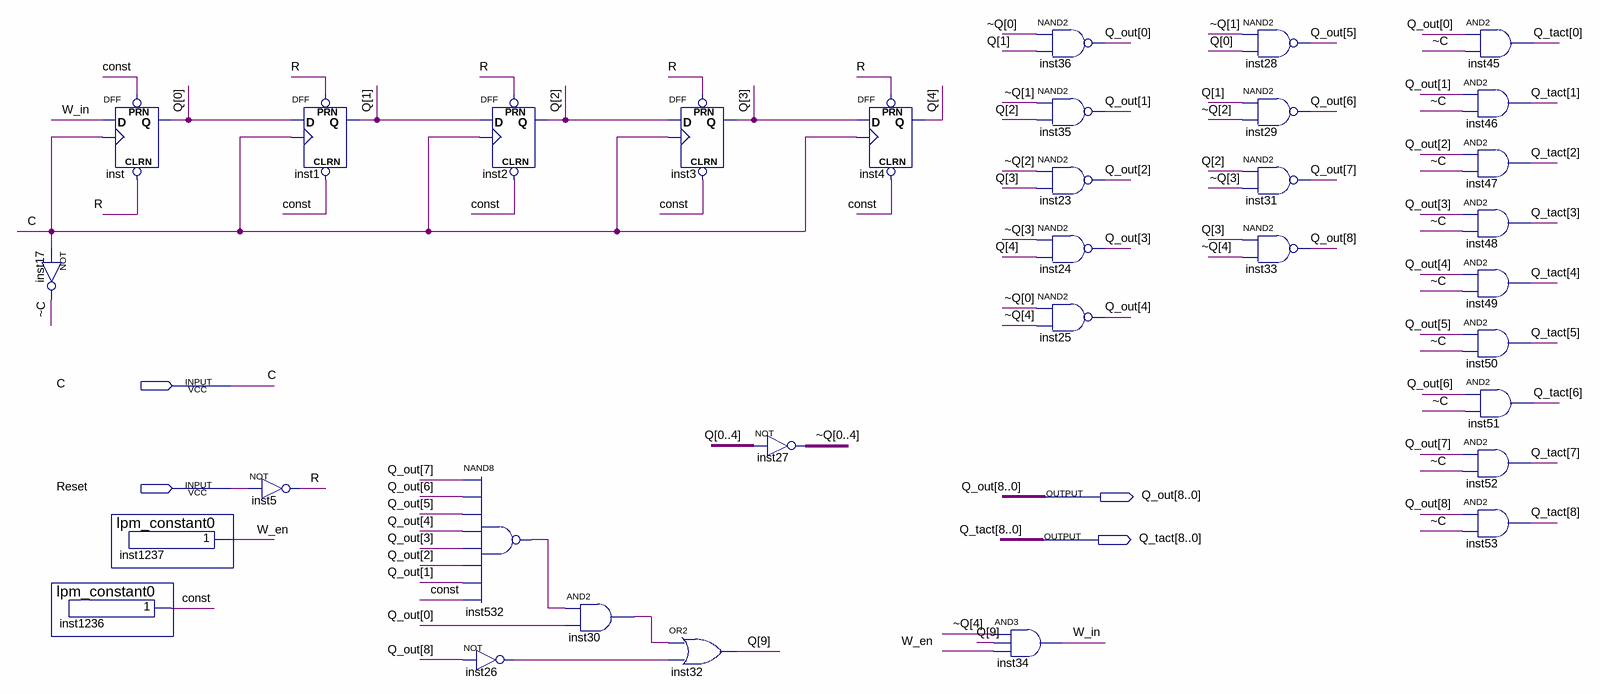
[diagram p0: schematic sheet]
// Quartus schematic Lab6_2.bdf as structural Verilog: 33 symbols, 4 pins
module Lab6_2 (
  input  C,
  input  Reset,
  output [8:0] Q_out,
  output [8:0] Q_tact
);

  wire \const , inst26_out, inst30_out, inst532_out, R, W_en, W_in, \~C ;
  wire [4:0] \~Q ;
  wire [9:0] Q;

  not inst17 (\~C , C);
  lpm_constant0 inst1236 (.result(\const ));
  DFF inst (.CLRN(R), .CLK(C), .D(W_in), .PRN(\const ), .Q(Q[0]));
  lpm_constant0 inst1237 (.result(W_en));
  DFF inst1 (.CLRN(\const ), .CLK(C), .D(Q[0]), .PRN(R), .Q(Q[1]));
  not inst5 (R, Reset);
  DFF inst2 (.CLRN(\const ), .CLK(C), .D(Q[1]), .PRN(R), .Q(Q[2]));
  nand inst532 (inst532_out, Q_out[7], Q_out[6], Q_out[5], Q_out[4], Q_out[3], Q_out[2], Q_out[1], \const );
  not inst26 (inst26_out, Q_out[8]);
  and inst30 (inst30_out, inst532_out, Q_out[0]);
  DFF inst3 (.CLRN(\const ), .CLK(C), .D(Q[2]), .PRN(R), .Q(Q[3]));
  or inst32 (Q[9], inst30_out, inst26_out);
  assign {\~Q [0], \~Q [1], \~Q [2], \~Q [3], \~Q [4]} = ~{Q[0], Q[1], Q[2], Q[3], Q[4]};  // NOT inst27, 5 bits wide
  DFF inst4 (.CLRN(\const ), .CLK(C), .D(Q[3]), .PRN(R), .Q(Q[4]));
  nand inst36 (Q_out[0], \~Q [0], Q[1]);
  nand inst35 (Q_out[1], \~Q [1], Q[2]);
  nand inst23 (Q_out[2], \~Q [2], Q[3]);
  nand inst24 (Q_out[3], \~Q [3], Q[4]);
  nand inst25 (Q_out[4], \~Q [0], \~Q [4]);
  and inst34 (W_in, \~Q [4], Q[9], W_en);
  nand inst28 (Q_out[5], \~Q [1], Q[0]);
  nand inst29 (Q_out[6], Q[1], \~Q [2]);
  nand inst31 (Q_out[7], Q[2], \~Q [3]);
  nand inst33 (Q_out[8], Q[3], \~Q [4]);
  and inst45 (Q_tact[0], Q_out[0], \~C );
  and inst46 (Q_tact[1], Q_out[1], \~C );
  and inst47 (Q_tact[2], Q_out[2], \~C );
  and inst48 (Q_tact[3], Q_out[3], \~C );
  and inst49 (Q_tact[4], Q_out[4], \~C );
  and inst50 (Q_tact[5], Q_out[5], \~C );
  and inst51 (Q_tact[6], Q_out[6], \~C );
  and inst52 (Q_tact[7], Q_out[7], \~C );
  and inst53 (Q_tact[8], Q_out[8], \~C );
endmodule
